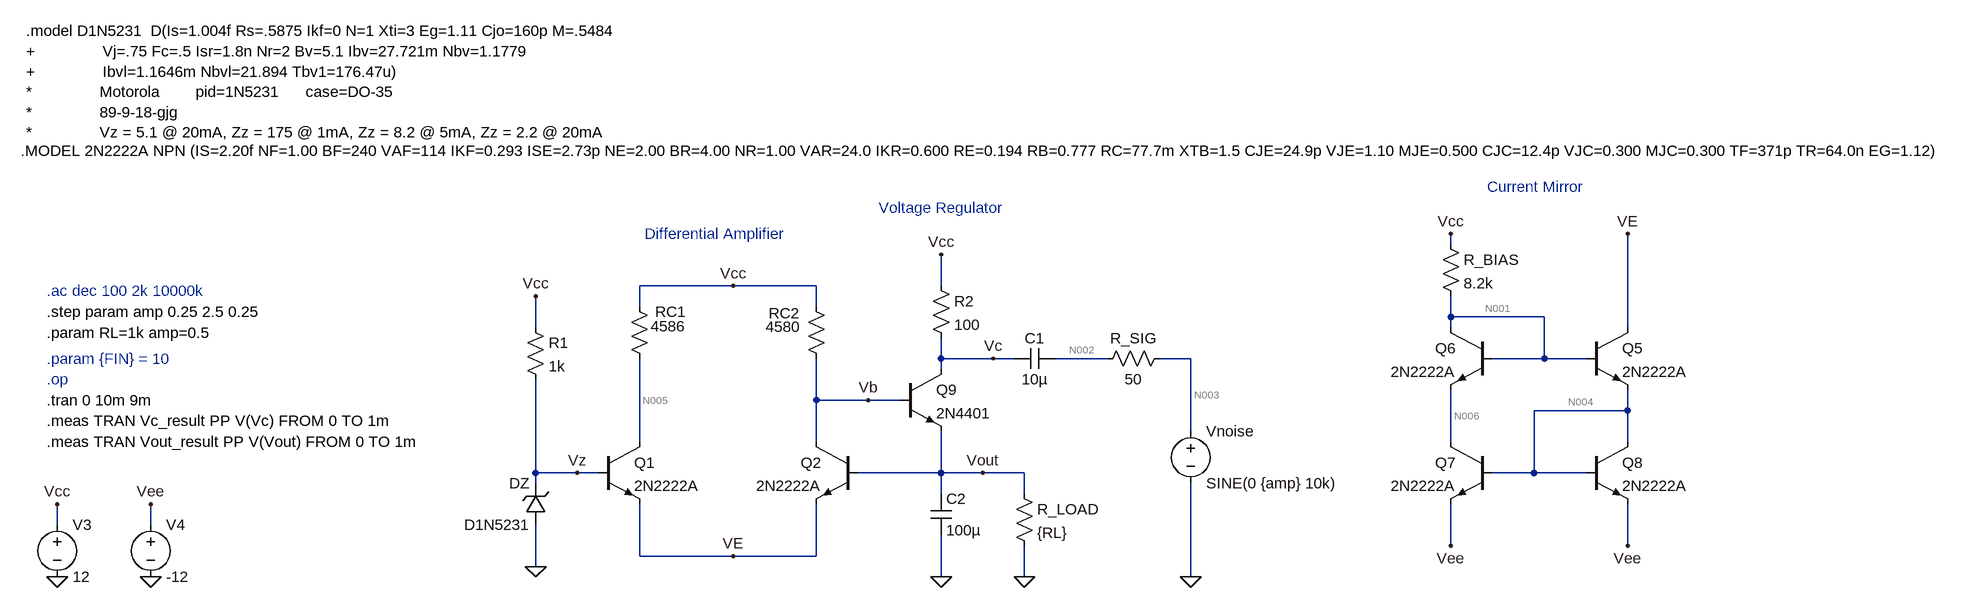
[diagram p0: schematic Diffamp with changes.asc]
Diffamp with changes.asc, the LTspice schematic file:
Version 4.1
SHEET 1 3976 1688
WIRE 2176 48 2176 32
WIRE 1072 112 928 112
WIRE 1200 112 1072 112
WIRE 1392 112 1392 64
WIRE 928 144 928 112
WIRE 1200 144 1200 112
WIRE 2176 160 2176 128
WIRE 2320 160 2176 160
WIRE 768 176 768 128
WIRE 2176 176 2176 160
WIRE 2448 176 2448 32
WIRE 1392 224 1392 192
WIRE 1472 224 1392 224
WIRE 1504 224 1472 224
WIRE 1648 224 1568 224
WIRE 1776 224 1728 224
WIRE 2320 224 2320 160
WIRE 2320 224 2240 224
WIRE 2384 224 2320 224
WIRE 1392 240 1392 224
WIRE 1200 288 1200 224
WIRE 1280 288 1200 288
WIRE 1328 288 1280 288
WIRE 2448 304 2448 272
WIRE 2448 304 2304 304
WIRE 1776 336 1776 224
WIRE 928 352 928 224
WIRE 1200 352 1200 288
WIRE 2176 352 2176 272
WIRE 2448 352 2448 304
WIRE 768 400 768 256
WIRE 832 400 768 400
WIRE 864 400 832 400
WIRE 1392 400 1392 336
WIRE 1392 400 1264 400
WIRE 1456 400 1392 400
WIRE 1520 400 1456 400
WIRE 2304 400 2304 304
WIRE 2304 400 2240 400
WIRE 2384 400 2304 400
WIRE 768 416 768 400
WIRE 1392 432 1392 400
WIRE 1520 432 1520 400
WIRE 32 480 32 448
WIRE 176 480 176 448
WIRE 2176 512 2176 448
WIRE 2448 512 2448 448
WIRE 928 528 928 448
WIRE 1072 528 928 528
WIRE 1200 528 1200 448
WIRE 1200 528 1072 528
WIRE 768 544 768 480
WIRE 1392 560 1392 496
WIRE 1520 560 1520 512
WIRE 1776 560 1776 416
FLAG 32 560 0
FLAG 32 448 Vcc
FLAG 1072 112 Vcc
FLAG 176 560 0
FLAG 176 448 Vee
FLAG 2176 32 Vcc
FLAG 2448 512 Vee
FLAG 2176 512 Vee
FLAG 1072 528 VE
FLAG 2448 32 VE
FLAG 1392 64 Vcc
FLAG 1520 560 0
FLAG 1392 560 0
FLAG 768 544 0
FLAG 768 128 Vcc
FLAG 1776 560 0
FLAG 1472 224 Vc
FLAG 1280 288 Vb
FLAG 1456 400 Vout
FLAG 832 400 Vz
SYMBOL voltage 32 464 R0
SYMATTR InstName V3
SYMATTR Value 12
SYMBOL npn 864 352 R0
SYMATTR InstName Q1
SYMATTR Value 2N2222A
SYMBOL npn 1264 352 M0
SYMATTR InstName Q2
SYMATTR Value 2N2222A
SYMBOL res 912 128 R0
WINDOW 0 40 24 Left 2
WINDOW 3 33 46 Left 2
SYMATTR InstName RC1
SYMATTR Value 4586
SYMATTR SpiceLine tol=5
SYMBOL res 1184 128 R0
WINDOW 0 -57 26 Left 2
WINDOW 3 -62 47 Left 2
SYMATTR InstName RC2
SYMATTR Value 4580
SYMATTR SpiceLine tol=5
SYMBOL voltage 176 464 R0
SYMATTR InstName V4
SYMATTR Value -12
SYMBOL npn 2384 176 R0
SYMATTR InstName Q5
SYMATTR Value 2N2222A
SYMBOL npn 2240 176 M0
SYMATTR InstName Q6
SYMATTR Value 2N2222A
SYMBOL npn 2240 352 M0
SYMATTR InstName Q7
SYMATTR Value 2N2222A
SYMBOL npn 2384 352 R0
SYMATTR InstName Q8
SYMATTR Value 2N2222A
SYMBOL res 2160 32 R0
SYMATTR InstName R_BIAS
SYMATTR Value 8.2k
SYMATTR SpiceLine tol=5
SYMBOL npn 1328 240 R0
SYMATTR InstName Q9
SYMATTR Value 2N4401
SYMBOL res 1376 96 R0
SYMATTR InstName R2
SYMATTR Value 100
SYMBOL cap 1568 208 R90
WINDOW 0 0 32 VBottom 2
WINDOW 3 32 32 VTop 2
SYMATTR InstName C1
SYMATTR Value 10µ
SYMBOL res 1744 208 R90
WINDOW 0 0 56 VBottom 2
WINDOW 3 32 56 VTop 2
SYMATTR InstName R_SIG
SYMATTR Value 50
SYMBOL voltage 1776 320 R0
WINDOW 123 0 0 Left 0
WINDOW 39 0 0 Left 0
SYMATTR InstName Vnoise
SYMATTR Value SINE(0 {amp} 10k)
SYMBOL cap 1376 432 R0
SYMATTR InstName C2
SYMATTR Value 100µ
SYMBOL res 1504 416 R0
SYMATTR InstName R_LOAD
SYMATTR Value {RL}
SYMBOL res 752 160 R0
SYMATTR InstName R1
SYMATTR Value 1k
SYMBOL zener 784 480 R180
WINDOW 0 24 64 Left 2
WINDOW 3 24 0 Left 2
SYMATTR InstName DZ
SYMATTR Value D1N5231
TEXT -24 -96 Left 2 !.MODEL 2N2222A NPN (IS=2.20f NF=1.00 BF=240 VAF=114 IKF=0.293 ISE=2.73p NE=2.00 BR=4.00 NR=1.00 VAR=24.0 IKR=0.600 RE=0.194 RB=0.777 RC=77.7m XTB=1.5 CJE=24.9p VJE=1.10 MJE=0.500 CJC=12.4p VJC=0.300 MJC=0.300 TF=371p TR=64.0n EG=1.12)
TEXT 16 120 Left 2 ;.ac dec 100 2k 10000k
TEXT 16 152 Left 2 !.step param amp 0.25 2.5 0.25
TEXT 16 184 Left 2 !.param RL=1k amp=0.5
TEXT 16 224 Left 2 ;.param {FIN} = 10
TEXT 16 256 Left 2 ;.op
TEXT 16 288 Left 2 !.tran 0 10m 9m
TEXT 936 32 Left 2 ;Differential Amplifier
TEXT 2232 -40 Left 2 ;Current Mirror
TEXT 1296 -8 Left 2 ;Voltage Regulator
TEXT -16 -280 Left 2 !.model D1N5231  D(Is=1.004f Rs=.5875 Ikf=0 N=1 Xti=3 Eg=1.11 Cjo=160p M=.5484\n+               Vj=.75 Fc=.5 Isr=1.8n Nr=2 Bv=5.1 Ibv=27.721m Nbv=1.1779\n+               Ibvl=1.1646m Nbvl=21.894 Tbv1=176.47u)\n*               Motorola        pid=1N5231      case=DO-35\n*               89-9-18-gjg\n*               Vz = 5.1 @ 20mA, Zz = 175 @ 1mA, Zz = 8.2 @ 5mA, Zz = 2.2 @ 20mA
TEXT 16 320 Left 2 !.meas TRAN Vc_result PP V(Vc) FROM 0 TO 1m
TEXT 16 352 Left 2 !.meas TRAN Vout_result PP V(Vout) FROM 0 TO 1m

The netlist it stands for:
* Diffamp with changes.asc
V3 Vcc 0 12
Q1 N005 Vz VE 0 2N2222A
Q2 Vb Vout VE 0 2N2222A
RC1 Vcc N005 4586 tol=5
RC2 Vcc Vb 4580 tol=5
V4 Vee 0 -12
Q5 VE N001 N004 0 2N2222A
Q6 N001 N001 N006 0 2N2222A
Q7 N006 N004 Vee 0 2N2222A
Q8 N004 N004 Vee 0 2N2222A
R_BIAS Vcc N001 8.2k tol=5
Q9 Vc Vb Vout 0 2N4401
R2 Vcc Vc 100
C1 N002 Vc 10µ
R_SIG N003 N002 50
Vnoise N003 0 SINE(0 {amp} 10k)
C2 Vout 0 100µ
R_LOAD Vout 0 {RL}
R1 Vcc Vz 1k
DZ 0 Vz D1N5231
.model D D
.lib standard.dio
.model NPN NPN
.model PNP PNP
.lib standard.bjt
.MODEL 2N2222A NPN (IS=2.20f NF=1.00 BF=240 VAF=114 IKF=0.293 ISE=2.73p NE=2.00 BR=4.00 NR=1.00 VAR=24.0 IKR=0.600 RE=0.194 RB=0.777 RC=77.7m XTB=1.5 CJE=24.9p VJE=1.10 MJE=0.500 CJC=12.4p VJC=0.300 MJC=0.300 TF=371p TR=64.0n EG=1.12)
* .ac dec 100 2k 10000k
.step param amp 0.25 2.5 0.25
.param RL=1k amp=0.5
* .param {FIN} = 10
* .op
.tran 0 10m 9m
* Differential Amplifier
* Current Mirror
* Voltage Regulator
.model D1N5231  D(Is=1.004f Rs=.5875 Ikf=0 N=1 Xti=3 Eg=1.11 Cjo=160p M=.5484
+               Vj=.75 Fc=.5 Isr=1.8n Nr=2 Bv=5.1 Ibv=27.721m Nbv=1.1779
+               Ibvl=1.1646m Nbvl=21.894 Tbv1=176.47u)
*               Motorola        pid=1N5231      case=DO-35
*               89-9-18-gjg
*               Vz = 5.1 @ 20mA, Zz = 175 @ 1mA, Zz = 8.2 @ 5mA, Zz = 2.2 @ 20mA
.meas TRAN Vc_result PP V(Vc) FROM 0 TO 1m
.meas TRAN Vout_result PP V(Vout) FROM 0 TO 1m
.backanno
.end

* Results of the author's LTspice run, read from the files saved beside the schematic
* Operating Point (first step), zero values left out:
*   V(n005) = 5.582 V
*   V(ve) = 4.353 V
*   V(vb) = 5.727 V
*   V(vee) = -12 V
*   V(n006) = -11.28 V
*   V(vcc) = 12 V
*   V(vz) = 5.057 V
*   V(vout) = 5.056 V
*   V(n001) = -10.56 V
*   V(n004) = -11.28 V
*   V(vc) = 11.5 V
*   Ic(Q2) = 1.339 mA
*   Ib(Q2) = 7.899 µA
*   Ie(Q2) = -1.347 mA
*   I(RC2) = 1.37 mA
*   I(R_BIAS) = 2.751 mA
*   I(R2) = 5.033 mA
*   I(V3) = -17.5 mA
*   I(V4) = 5.505 mA
*   Ic(Q6) = 2.723 mA
*   Ib(Q6) = 14.91 µA
*   Ie(Q6) = -2.738 mA
*   I(R1) = 6.943 mA
*   Ic(Q1) = 1.399 mA
*   Ib(Q1) = 8.218 µA
*   Ie(Q1) = -1.408 mA
*   Ic(Q5) = 2.754 mA
*   Ib(Q5) = 13.44 µA
*   Ie(Q5) = -2.768 mA
*   Ic(Q7) = 2.738 mA
*   Ib(Q7) = 14.98 µA
*   Ie(Q7) = -2.753 mA
*   Ic(Q8) = 2.738 mA
*   Ib(Q8) = 14.98 µA
*   Ie(Q8) = -2.753 mA
*   Ic(Q9) = 5.033 mA
*   Ib(Q9) = 30.95 µA
*   Ie(Q9) = -5.064 mA
*   I(DZ) = -6.935 mA
*   I(RC1) = 1.399 mA
*   I(R_LOAD) = 5.056 mA
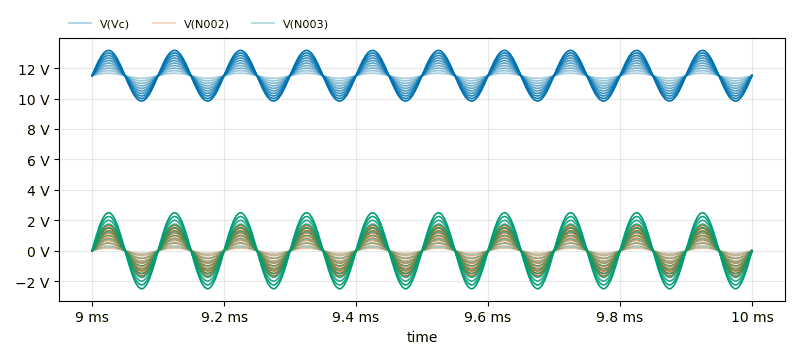
[diagram p1: Transient Analysis of Diffamp with changes.asc, plotted from the saved traces]
* Transient Analysis, 10 runs:
*   V(Vc) [amp=0.25]: min 11.33 V, max 11.66 V, average 11.5 V, rms 11.5 V, last 11.5 V
*   V(Vc) [amp=0.5]: min 11.16 V, max 11.83 V, average 11.5 V, rms 11.5 V, last 11.5 V
*   V(Vc) [amp=0.75]: min 11 V, max 12 V, average 11.5 V, rms 11.5 V, last 11.5 V
*   V(Vc) [amp=1]: min 10.83 V, max 12.16 V, average 11.5 V, rms 11.51 V, last 11.5 V
*   V(Vc) [amp=1.25]: min 10.66 V, max 12.33 V, average 11.5 V, rms 11.51 V, last 11.5 V
*   V(Vc) [amp=1.5]: min 10.5 V, max 12.5 V, average 11.5 V, rms 11.52 V, last 11.51 V
*   V(Vc) [amp=1.75]: min 10.33 V, max 12.66 V, average 11.5 V, rms 11.53 V, last 11.51 V
*   V(Vc) [amp=2]: min 10.16 V, max 12.83 V, average 11.5 V, rms 11.54 V, last 11.51 V
*   V(N002) [amp=0.25]: min -166.6 mV, max 166.6 mV, average 10.91 µV, rms 117.9 mV, last -1.2 mV
*   V(N002) [amp=0.5]: min -333.1 mV, max 333.2 mV, average 22.1 µV, rms 235.8 mV, last -2.4 mV
*   V(N002) [amp=0.75]: min -499.7 mV, max 499.8 mV, average 33.3 µV, rms 353.7 mV, last -3.599 mV
*   V(N002) [amp=1]: min -666.2 mV, max 666.4 mV, average 44.49 µV, rms 471.6 mV, last -4.798 mV
*   V(N002) [amp=1.25]: min -832.8 mV, max 833.1 mV, average 55.69 µV, rms 589.5 mV, last -5.996 mV
*   V(N002) [amp=1.5]: min -999.3 mV, max 999.7 mV, average 66.9 µV, rms 707.3 mV, last -7.194 mV
*   V(N002) [amp=1.75]: min -1.166 V, max 1.166 V, average 78.11 µV, rms 825.2 mV, last -8.392 mV
*   V(N002) [amp=2]: min -1.332 V, max 1.333 V, average 89.32 µV, rms 943.1 mV, last -9.589 mV
*   V(N003) [amp=0.25]: min -250 mV, max 250 mV, average 1.725 µV, rms 176.9 mV, last 0 V
*   V(N003) [amp=0.5]: min -499.9 mV, max 500 mV, average 3.451 µV, rms 353.8 mV, last 0 V
*   V(N003) [amp=0.75]: min -749.9 mV, max 750 mV, average 5.176 µV, rms 530.7 mV, last 0 V
*   V(N003) [amp=1]: min -999.9 mV, max 1 V, average 6.902 µV, rms 707.6 mV, last 0 V
*   V(N003) [amp=1.25]: min -1.25 V, max 1.25 V, average 8.628 µV, rms 884.5 mV, last 0 V
*   V(N003) [amp=1.5]: min -1.5 V, max 1.5 V, average 10.35 µV, rms 1.061 V, last 0 V
*   V(N003) [amp=1.75]: min -1.75 V, max 1.75 V, average 12.08 µV, rms 1.238 V, last 0 V
*   V(N003) [amp=2]: min -2 V, max 2 V, average 13.8 µV, rms 1.415 V, last 0 V
* From the log:
*   Measurement: Vc_result
*     step  PP(V(Vc))  FROM  TO
*        1  0.333117485046  0  0.001
*        2  0.666234970093  0  0.001
*        3  0.999352455139  0  0.001
*        4  1.33247089386  0  0.001
*        5  1.66558933258  0  0.001
*        6  1.99870681763  0  0.001
*        7  2.33182621002  0  0.001
*        8  2.66494560242  0  0.001
*        9  2.99806594849  0  0.001
*       10  3.33118629456  0  0.001
*   Measurement: Vout_result
*     step  PP(V(Vout))  FROM  TO
*        1  3.33786010742e-06  0  0.001
*        2  6.19888305664e-06  0  0.001
*        3  9.53674316406e-06  0  0.001
*        4  1.28746032715e-05  0  0.001
*        5  1.62124633789e-05  0  0.001
*        6  1.90734863281e-05  0  0.001
*        7  2.24113464355e-05  0  0.001
*        8  2.5749206543e-05  0  0.001
*        9  2.86102294922e-05  0  0.001
*       10  3.19480895996e-05  0  0.001